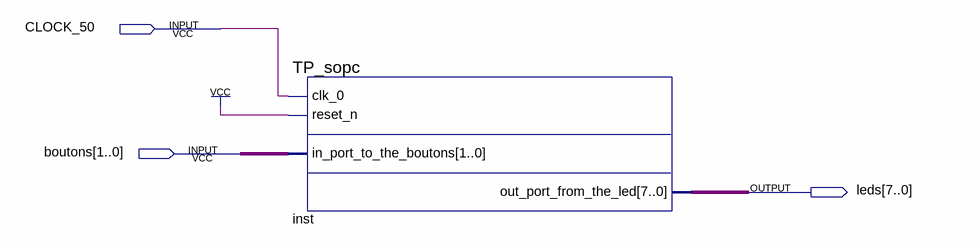
[diagram p0: schematic sheet]
// Quartus schematic sopc.bdf as structural Verilog: 1 symbols, 3 pins
module sopc (
  input  CLOCK_50,
  input  [1:0] boutons,
  output [7:0] leds
);

  TP_sopc inst (.clk_0(CLOCK_50), .reset_n(1'b1), .in_port_to_the_boutons(boutons), .out_port_from_the_led(leds));
endmodule
